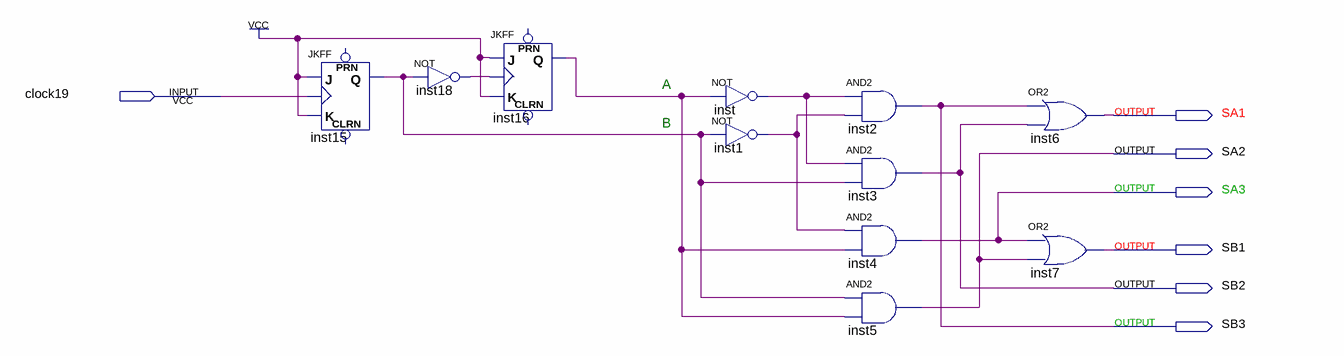
[diagram p0: schematic sheet]
// Quartus schematic semaforo_contador.bdf as structural Verilog: 11 symbols, 7 pins
module semaforo_contador (
  input  clock19,
  output SA1,
  output SA2,
  output SA3,
  output SB1,
  output SB2,
  output SB3
);

  wire inst1_out, inst15_q, inst16_q, inst18_out, inst_out;

  JKFF inst15 (.K(1'b1), .J(1'b1), .CLK(clock19), .Q(inst15_q));  // open: PRN, CLRN
  not inst18 (inst18_out, inst15_q);
  JKFF inst16 (.K(1'b1), .J(1'b1), .CLK(inst18_out), .Q(inst16_q));  // open: PRN, CLRN
  not inst (inst_out, inst16_q);
  not inst1 (inst1_out, inst15_q);
  and inst2 (SB3, inst_out, inst1_out);
  and inst3 (SB2, inst_out, inst15_q);
  and inst4 (SA3, inst1_out, inst16_q);
  and inst5 (SA2, inst15_q, inst16_q);
  or inst6 (SA1, SB3, SB2);
  or inst7 (SB1, SA3, SA2);

  // Notes on the sheet:
  //   A
  //   B
endmodule
